# Altium schematic sheet Power.SchDoc
size A4
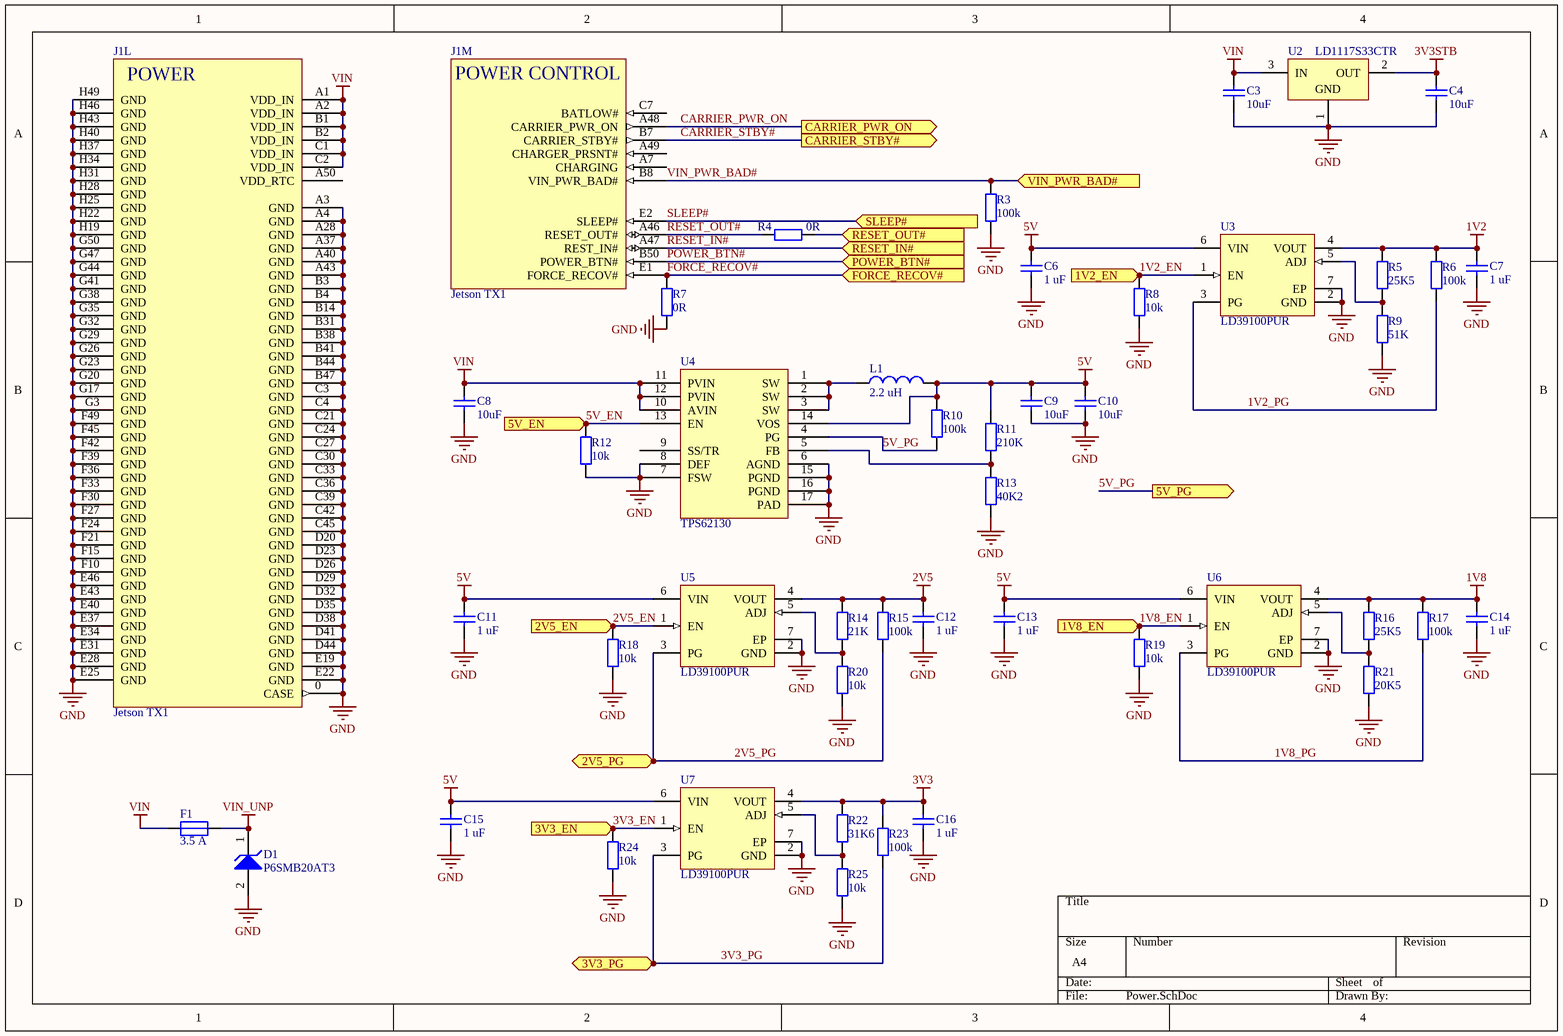
[diagram p0: Power.SchDoc]

## Parts
C3  value 10uF  [1206_1.6_M]  (hidden comment: TMK316B7106KL-TD)
C4  value 10uF  [0603C_M]  (hidden comment: GRM188R60J106ME47D)
C6  Capacitance: 1 uF  [0603C_M]  (hidden comment: GRM188R61A105KA61D)
C7  Capacitance: 1 uF  [0603C_M]  (hidden comment: GRM188R61A105KA61D)
C8  value 10uF  [1206_1.6_M]  (hidden comment: TMK316B7106KL-TD)
C9  value 10uF  [0603C_M]  (hidden comment: GRM188R60J106ME47D)
C10  value 10uF  [0603C_M]  (hidden comment: GRM188R60J106ME47D)
C11  Capacitance: 1 uF  [0603C_M]  (hidden comment: GRM188R61A105KA61D)
C12  Capacitance: 1 uF  [0603C_M]  (hidden comment: GRM188R61A105KA61D)
C13  Capacitance: 1 uF  [0603C_M]  (hidden comment: GRM188R61A105KA61D)
C14  Capacitance: 1 uF  [0603C_M]  (hidden comment: GRM188R61A105KA61D)
C15  Capacitance: 1 uF  [0603C_M]  (hidden comment: GRM188R61A105KA61D)
C16  Capacitance: 1 uF  [0603C_M]  (hidden comment: GRM188R61A105KA61D)
D1  P6SMB20AT3  [ONSC-SMB-2-403A-03_J_V]
F1  Current Rating: 3.5 A  [0603R_0.45_M]  (hidden comment: 0603SFV350F/32-2)
J1  Jetson TX1  [Nvidia Jetson TX1]  (parts L,M of 14)
L1  Inductance: 2.2 uH  [XFL4020_M]  (hidden comment: XFL4020-222MEC)
R3  Resistance: 100k  [0402R_M]  (hidden comment: CRCW0402100KJNED)
R4  value 0R  [0402R_M]  (hidden comment: Generic resitor)
R5  value 25K5  [0402R_M]  (hidden comment: CRCW040225K5FKED)
R6  Resistance: 100k  [0402R_M]  (hidden comment: CRCW0402100KJNED)
R7  value 0R  [0402R_M]  (hidden comment: Generic resitor)
R8  value 10k  [0402R_M]  (hidden comment: CRCW040210K0FKED)
R9  value 51K  [0402R_M]  (hidden comment: CRCW040251K0FKED)
R10  Resistance: 100k  [0402R_M]  (hidden comment: CRCW0402100KJNED)
R11  value 210K  [0402R_M]  (hidden comment: CRCW0402210KFKED)
R12  value 10k  [0402R_M]  (hidden comment: CRCW040210K0FKED)
R13  value 40K2  [0402R_M]  (hidden comment: CRCW040240K2FKED)
R14  value 21K  [0402R_M]  (hidden comment: CRCW040221K0FKED)
R15  Resistance: 100k  [0402R_M]  (hidden comment: CRCW0402100KJNED)
R16  value 25K5  [0402R_M]  (hidden comment: CRCW040225K5FKED)
R17  Resistance: 100k  [0402R_M]  (hidden comment: CRCW0402100KJNED)
R18  value 10k  [0402R_M]  (hidden comment: CRCW040210K0FKED)
R19  value 10k  [0402R_M]  (hidden comment: CRCW040210K0FKED)
R20  value 10k  [0402R_M]  (hidden comment: CRCW040210K0FKED)
R21  value 20K5  [0402R_M]  (hidden comment: CRCW040220K5FKED)
R22  value 31K6  [0402R_M]  (hidden comment: CRCW040231K6FKED)
R23  Resistance: 100k  [0402R_M]  (hidden comment: CRCW0402100KJNED)
R24  value 10k  [0402R_M]  (hidden comment: CRCW040210K0FKED)
R25  value 10k  [0402R_M]  (hidden comment: CRCW040210K0FKED)
U2  LD1117S33CTR  [SOT-223_L]
U3  LD39100PUR  [DFN6D_M]
U4  TPS62130  [VQFN1_16_L]
U5  LD39100PUR  [DFN6D_M]
U6  LD39100PUR  [DFN6D_M]
U7  LD39100PUR  [DFN6D_M]

## Ports
1V2_EN (in), 1V8_EN (in), 2V5_EN (in), 2V5_PG (out), 3V3_EN (in), 3V3_PG (out), 5V_EN (in), 5V_PG (out), CARRIER_PWR_ON (out), CARRIER_STBY# (out), FORCE_RECOV# (in), POWER_BTN# (in), RESET_IN# (in), RESET_OUT# (in), SLEEP# (in), VIN_PWR_BAD# (in)

## Nets
1V2: C7.2 R5.2 R6.2 U3.4(VOUT)
1V8: C14.2 R16.2 R17.2 U6.4(VOUT)
2V5: C12.2 R14.2 R15.2 U5.4(VOUT)
3V3: C16.2 R22.2 R23.2 U7.4(VOUT)
3V3STB: C4.2 U2.2(OUT)
5V: C6.2 C9.2 C10.2 C11.2 C13.2 C15.2 L1.2 R10.2 R11.2 U3.6(VIN) U4.14(VOS) U5.6(VIN) U6.6(VIN) U7.6(VIN)
GND: C3.1 C4.1 C6.1 C7.1 C8.1 C9.1 C10.1 C11.1 C12.1 C13.1 C14.1 C15.1 C16.1 D1.2(A) J1.0(CASE) J1.A3(GND) J1.A4(GND) J1.A28(GND) J1.A37(GND) J1.A40(GND) J1.A43(GND) J1.B3(GND) J1.B4(GND) J1.B14(GND) J1.B31(GND) J1.B38(GND) J1.B41(GND) J1.B44(GND) J1.B47(GND) J1.C3(GND) J1.C4(GND) J1.C21(GND) J1.C24(GND) J1.C27(GND) J1.C30(GND) J1.C33(GND) J1.C36(GND) J1.C39(GND) J1.C42(GND) J1.C45(GND) J1.D20(GND) J1.D23(GND) J1.D26(GND) J1.D29(GND) J1.D32(GND) J1.D35(GND) J1.D38(GND) J1.D41(GND) J1.D44(GND) J1.E19(GND) J1.E22(GND) J1.E25(GND) J1.E28(GND) J1.E31(GND) J1.E34(GND) J1.E37(GND) J1.E40(GND) J1.E43(GND) J1.E46(GND) J1.F10(GND) J1.F15(GND) J1.F21(GND) J1.F24(GND) J1.F27(GND) J1.F30(GND) J1.F33(GND) J1.F36(GND) J1.F39(GND) J1.F42(GND) J1.F45(GND) J1.F49(GND) J1.G3(GND) J1.G17(GND) J1.G20(GND) J1.G23(GND) J1.G26(GND) J1.G29(GND) J1.G32(GND) J1.G35(GND) J1.G38(GND) J1.G41(GND) J1.G44(GND) J1.G47(GND) J1.G50(GND) J1.H19(GND) J1.H22(GND) J1.H25(GND) J1.H28(GND) J1.H31(GND) J1.H34(GND) J1.H37(GND) J1.H40(GND) J1.H43(GND) J1.H46(GND) J1.H49(GND) R3.1 R7.1 R8.1 R9.1 R12.1 R13.1 R18.1 R19.1 R20.1 R21.1 R24.1 R25.1 U2.1(GND) U3.2(GND) U3.7(EP) U4.6(AGND) U4.7(FSW) U4.8(DEF) U4.15(PGND) U4.16(PGND) U4.17(PAD) U5.2(GND) U5.7(EP) U6.2(GND) U6.7(EP) U7.2(GND) U7.7(EP)
VIN: C3.2 C8.2 F1.1 J1.A1(VDD_IN) J1.A2(VDD_IN) J1.B1(VDD_IN) J1.B2(VDD_IN) J1.C1(VDD_IN) J1.C2(VDD_IN) U2.3(IN) U4.10(AVIN) U4.11(PVIN) U4.12(PVIN)
VIN_UNP: D1.1(K) F1.2
1V2_EN: R8.2 U3.1(EN) ; port 1V2_EN
1V2_PG: R6.1 U3.3(PG)
1V8_EN: R19.2 U6.1(EN) ; port 1V8_EN
1V8_PG: R17.1 U6.3(PG)
2V5_EN: R18.2 U5.1(EN) ; port 2V5_EN
2V5_PG: R15.1 U5.3(PG) ; port 2V5_PG
3V3_EN: R24.2 U7.1(EN) ; port 3V3_EN
3V3_PG: R23.1 U7.3(PG) ; port 3V3_PG
5V_EN: R12.2 U4.13(EN) ; port 5V_EN
5V_PG: R10.1 U4.4(PG) ; port 5V_PG
CARRIER_PWR_ON: J1.A48(CARRIER_PWR_ON) ; port CARRIER_PWR_ON
CARRIER_STBY#: J1.B7(CARRIER_STBY#) ; port CARRIER_STBY#
FORCE_RECOV#: J1.E1(FORCE_RECOV#) R7.2 ; port FORCE_RECOV#
POWER_BTN#: J1.B50(POWER_BTN#) ; port POWER_BTN#
RESET_IN#: J1.A47(REST_IN#) ; port RESET_IN#
RESET_OUT#: J1.A46(RESET_OUT#) R4.1
RESET_OUT#: R4.2 ; port RESET_OUT#  [a separate net that carries the same name]
SLEEP#: J1.E2(SLEEP#) ; port SLEEP#
VIN_PWR_BAD#: J1.B8(VIN_PWR_BAD#) R3.2 ; port VIN_PWR_BAD#
NetL1_1: L1.1 U4.1(SW) U4.2(SW) U4.3(SW)
NetR5_1: R5.1 R9.2 U3.5(ADJ)
NetR11_1: R11.1 R13.2 U4.5(FB)
NetR14_1: R14.1 R20.2 U5.5(ADJ)
NetR16_1: R16.1 R21.2 U6.5(ADJ)
NetR22_1: R22.1 R25.2 U7.5(ADJ)

Not connected (* = marked no-connect by the designer): J1 A7(CHARGING) A49(CHARGER_PRSNT#) A50(VDD_RTC) C7(BATLOW#); U4 9(SS/TR)

## Notes on the sheet
- (in symbol NVIDIA_Jetson_TX1, part L) POWER
- (in symbol NVIDIA_Jetson_TX1, part M) POWER CONTROL

## Library data of the parts
C3 C8 = TMK316B7106KL-TD: CAP CER 1206 10uF 25V X7R 10%; Manufacturer: Taiyo Yuden; Type: Multilayer Ceramic Capacitor; Voltage Rating DC: 25 VDC; Qualification: AEC-Q200; Manufacturer Part Number: TMK316B7106KL-TD; RoHS: RoHS Compliant; Category: Multilayer Ceramic Capacitors MLCC - SMD/SMT; Capacitance: 10 uF; Height: 1.6 mm; Length: 3.2 mm; Package/Case: 1206 (3216 metric); Packaging: Reel; Product: General Type MLCCs; Series: M; Termination Style: SMD/SMT; Tolerance: 10 %; Width: 1.6 mm; Brand: Taiyo Yuden; Case Code - in: 1206; Case Code - mm: 3216; Dielectric: X7R; Maximum Operating Temperature: + 125 C; Minimum Operating Temperature: - 55 C; Standard Pack Qty: 2000; RoHS - Mouser: Y; Minimum Order Quantity: 1; Reeling: True; ComponentLink1URL: http://www.mouser.com/ds/2/396/mlcc_all_e-541559.pdf; ComponentLink1Description: http://www.mouser.com/ds/2/396/mlcc_all_e-541559.pdf
C4 C9 C10 = GRM188R60J106ME47D: CAP CER 10UF 6.3V X5R 0603; Manufacturer: Murata Electronics North America; Tolerance: ±20%; Supplier 1: Digi-Key; Manufacturer Part Number: GRM188R60J106ME47D; RoHS: RoHS Compliant; Category: Capacitors; Stock 1: 13697850; Pricing 1: 1=0.17, 10=0.123, 100=0.0578, 500=0.04052, 1000=0.03355 (USD); Packaging: Cut Tape (CT); Part Status: Active; Voltage - Rated: 6.3V; Temperature Coefficient: X5R; Operating Temperature: -55°C ~ 85°C; Features: -; Ratings: -; Applications: General Purpose; Mounting Type: Surface Mount, MLCC; Package / Case: 0603 (1608 Metric); Size / Dimension: 0.063" L x 0.031" W (1.60mm x 0.80mm); Height - Seated (Max): -; Thickness (Max): 0.035" (0.90mm); Lead Spacing: -; Lead Style: -; ComponentLink1URL: http://www.murata.com/~/media/webrenewal/support/library/catalog/products/capacitor/mlcc/c02e.pdf; ComponentLink1Description: http://www.murata.com/~/media/webrenewal/support/library/catalog/products/capacitor/mlcc/c02e.pdf; Supplier Part Number 1: 490-3896-1-ND
C6 C7 C11-C16 = GRM188R61A105KA61D: CAP CER 1UF 10V X5R 0603; Manufacturer: Murata; Capacitance - nF: 1000 nF; Brand: Murata Electronics; Tolerance: 10 %; Case Height: 0.8 mm; Case Length: 1.6 mm; Temperature Coefficient / Code: +/- 15 %; Type: General Purpose MLCC; Supplier 1: Digi-Key; Manufacturer Part Number: GRM188R61A105KA61D; Stock 1: 2238936; Pricing 1: 1=0.1, 10=0.04, 100=0.0178, 500=0.0127, 1000=0.01 (USD); Dimensions: 0.8 mm W x 1.6 mm L x 0.8 mm H; Product Category: Multilayer Ceramic Capacitors MLCC - SMD/SMT; RoHS: Details; Voltage Rating DC: 10 V; Dielectric: X5R; Case Code - in: 0603; Case Code - mm: 1608; Minimum Operating Temperature: - 55 C; Maximum Operating Temperature: + 85 C; Product: General Type MLCCs; Case Width: 0.8 mm; Operating Temperature Range: - 55 C to + 85 C; Package / Case: 0603 (1608 metric); Packaging: Reel; Series: GRM; Factory Pack Quantity: 4000; Termination Style: SMD/SMT; ComponentLink1URL: https://datasheet.ciiva.com/18102/getdatasheetpartid-85467-18102910.pdf; ComponentLink1Description: https://datasheet.ciiva.com/18102/getdatasheetpartid-85467-18102910.pdf; ComponentLink2URL: https://datasheet.ciiva.com/19476/1857381-19476568.pdf; ComponentLink2Description: https://datasheet.ciiva.com/19476/1857381-19476568.pdf; ComponentLink3URL: https://datasheet.ciiva.com/131/partnumbering-e-01-131743.pdf; ComponentLink3Description: https://datasheet.ciiva.com/131/partnumbering-e-01-131743.pdf; ComponentLink4URL: https://datasheet.ciiva.com/22706/608985-22706782.pdf; ComponentLink4Description: https://datasheet.ciiva.com/22706/608985-22706782.pdf; ComponentLink5URL: https://datasheet.ciiva.com/131/partnumbering-e-01-131742.pdf; ComponentLink5Description: https://datasheet.ciiva.com/131/partnumbering-e-01-131742.pdf; ComponentLink6URL: https://datasheet.ciiva.com/7719/608985-7719036.pdf; ComponentLink6Description: https://datasheet.ciiva.com/7719/608985-7719036.pdf; ComponentLink7URL: https://datasheet.ciiva.com/16199/product-16199724.pdf; ComponentLink7Description: https://datasheet.ciiva.com/16199/product-16199724.pdf; ComponentLink8URL: https://datasheet.ciiva.com/131/partnumbering-e-01-131741.pdf; ComponentLink8Description: https://datasheet.ciiva.com/131/partnumbering-e-01-131741.pdf; Supplier Part Number 1: 490-1543-1-ND; Voltage Rating: 10 V
D1 = CMP-1061-00394-1: 600 W Peak Power Zener Transient Voltage Suppressor, Unidirectional, 2-Pin SMB, Tape and Reel; Manufacturer: On Semiconductor; PPK Max (W): 600; IR Max (uA): 5; V(BR) Typ (V): 20; PartNumber: P6SMB20AT3; Direction: Unidirectional; ComponentLink2URL: http://www.onsemi.com/pub_link/Collateral/P6SMB6.8AT3-D.PDF; PackageVersion: Rev. J, 07/2012; ComponentLink1URL: http://www.onsemi.com/; PackageReference: SMB-2-403A-03_J; Mounting Technology: Surface Mount; DatasheetVersion: Rev. J; ComponentLink2Description: Datasheet; Packing: Tape and Reel; ComponentLink1Description: Manufacturer URL; ComponentLink3Description: Package Specification; ComponentLink3URL: http://www.onsemi.com/pub_link/Collateral/P6SMB6.8AT3-D.PDF; PackageDescription: 2-Pin Small Molded Package, J-Bend Lead, Body 4.33 x 3.625 mm
F1 = 0603SFV350F/32-2: FUSE 0603 3.5A FAST; Manufacturer: TE Connectivity / Raychem; Voltage Rating DC: 32 VDC; Fuse Size / Group: 0603 (1608 metric); Fuse Type: Fast Blow; Interrupt Rating: 35 Amps; Supplier 1: Mouser; Manufacturer Part Number: 0603SFV350F/32-2; RoHS: RoHS Compliant; Category: Surface Mount Fuses; Stock 1: 16912; Pricing 1: 1=0.824, 10=0.621, 100=0.518, 250=0.505, 500=0.427, 1000=0.376, 2500=0.349, 6000=0.337, 12000=0.332 (EUR); Height: 0.51 mm; Length: 1.75 mm; Operating Temperature Range: - 55 C to + 125 C; Packaging: Reel; Product: Surface Mount Fuse; Series: SFV; Width: 0.48 mm; Brand: TE Connectivity / Raychem; Standard Pack Qty: 6000; RoHS - Mouser: Y; Minimum Order Quantity: 1; Reeling: True; ComponentLink1URL: http://www.mouser.com/ds/2/418/NG_CS_CLP00009_A_CLP00009-735180.pdf; ComponentLink1Description: http://www.mouser.com/ds/2/418/NG_CS_CLP00009_A_CLP00009-735180.pdf; Supplier Part Number 1: 650-0603SFV350F/32-2
J1 = NVIDIA_Jetson_TX1: Nvidia computing module
L1 = XFL4020-222MEC: Fixed Inductors Power Inductor 2.2 uH 20 % 8 A / Learn More; Manufacturer: Coilcraft; Part # Aliases: XFL4020-222MEB; Case Height: 2.1 mm; Case Length: 4.3 mm; Core Material: Composite; Maximum DC Current: 8 A; Maximum DC Resistance: 23.5 mOhms; Tolerance: 20 %; Self Resonant Frequency: 38 MHz; Shielding: Shielded; Test Frequency: 100 kHz; Supplier 1: Farnell; Manufacturer Part Number: XFL4020-222MEC; Stock 1: 19632; Pricing 1: 1=2.09, 50=1.81, 100=1.52, 250=1.18 (EUR); Dimensions: 4.3 mm W x 4.3 mm L x 2.1 mm H; Case Width: 4.3 mm; RoHS: Details; Operating Temperature Range: - 40 C to + 125 C; Packaging: Reel; Product: Power Inductors; Termination Style: SMD/SMT; Series: XFL4020; ComponentLink1URL: https://datasheet.ciiva.com/22679/1682010-22679278.pdf; ComponentLink1Description: https://datasheet.ciiva.com/22679/1682010-22679278.pdf; ComponentLink2URL: https://datasheet.ciiva.com/22679/1682010-22679277.pdf; ComponentLink2Description: https://datasheet.ciiva.com/22679/1682010-22679277.pdf; Supplier Part Number 1: 2289216
R3 R6 R10 R15 R17 R23 = CRCW0402100KJNED: RES SMD 100K OHM 5% 1/16W 0402; Manufacturer: Vishay; Brand: Vishay / Dale; Power Rating: 63 mW; Temperature Coefficient: 200 PPM / K; Voltage Rating: 50 V; Unit Weight: 0.000023 oz; Supplier 1: Digi-Key; Manufacturer Part Number: CRCW0402100KJNED; Stock 1: 174; Pricing 1: 1=0.1, 10=0.025, 100=0.01, 1000=0.0045, 2500=0.0039, 5000=0.0032 (USD); Product Category: Thick Film Resistors - SMD; RoHS: Details; Tolerance: 5 %; Case Code - in: 0402; Case Code - mm: 1005; Operating Temperature Range: - 55 C to + 155 C; Series: CRCW; Height: 0.35 mm; Length: 1 mm; Package / Case: 0402 (1005 metric); Packaging: Reel; Product: Thick Film Resistors SMD; Factory Pack Quantity: 10000; Termination Style: SMD/SMT; Width: 0.5 mm; ComponentLink1URL: https://datasheet.ciiva.com/3255/dcrcwe3-3255949.pdf; ComponentLink1Description: https://datasheet.ciiva.com/3255/dcrcwe3-3255949.pdf; ComponentLink2URL: https://datasheet.ciiva.com/28420/dcrcwe3-28420124.pdf; ComponentLink2Description: https://datasheet.ciiva.com/28420/dcrcwe3-28420124.pdf; ComponentLink3URL: https://datasheet.ciiva.com/3255/dcrcwe3-3255950.pdf; ComponentLink3Description: https://datasheet.ciiva.com/3255/dcrcwe3-3255950.pdf; ComponentLink4URL: https://datasheet.ciiva.com/28621/1847332-28621326.pdf; ComponentLink4Description: https://datasheet.ciiva.com/28621/1847332-28621326.pdf; ComponentLink5URL: https://datasheet.ciiva.com/16763/70201119-16763038.pdf; ComponentLink5Description: https://datasheet.ciiva.com/16763/70201119-16763038.pdf; ComponentLink6URL: https://datasheet.ciiva.com/2461/dcrcwe3-2461990.pdf; ComponentLink6Description: https://datasheet.ciiva.com/2461/dcrcwe3-2461990.pdf; ComponentLink7URL: https://datasheet.ciiva.com/2461/dcrcwe3-2461989.pdf; ComponentLink7Description: https://datasheet.ciiva.com/2461/dcrcwe3-2461989.pdf; ComponentLink8URL: https://datasheet.ciiva.com/2461/dcrcwe3-2461991.pdf; ComponentLink8Description: https://datasheet.ciiva.com/2461/dcrcwe3-2461991.pdf; ComponentLink9URL: https://datasheet.ciiva.com/7777/1533075-7777191.pdf; ComponentLink9Description: https://datasheet.ciiva.com/7777/1533075-7777191.pdf; ComponentLink10URL: https://datasheet.ciiva.com/5552/dcrcwe3-109170-5552439.pdf; ComponentLink10Description: https://datasheet.ciiva.com/5552/dcrcwe3-109170-5552439.pdf; Supplier Part Number 1: 541-100KJDKR-ND
R4 R7 = Resistor
R5 R16 = CRCW040225K5FKED: RES SMD 25.5K OHM 1% 1/16W 0402; Manufacturer: Vishay Dale; Power (Watts): 0.063W, 1/16W; Temperature Coefficient: ±100ppm/°C; Supplier 1: Digi-Key; Manufacturer Part Number: CRCW040225K5FKED; RoHS: RoHS Compliant; Category: Resistors; Stock 1: 51405; Pricing 1: 1=0.1, 10=0.037, 100=0.0149, 1000=0.0067, 2500=0.00582, 5000=0.00481 (USD); Packaging: Cut Tape (CT); Part Status: Active; Tolerance: ±1%; Composition: Thick Film; Features: Automotive AEC-Q200; Operating Temperature: -55°C ~ 155°C; Package / Case: 0402 (1005 Metric); Supplier Device Package: 0402; Size / Dimension: 0.039" L x 0.020" W (1.00mm x 0.50mm); Height - Seated (Max): 0.016" (0.40mm); Failure Rate: -; ComponentLink1URL: http://www.vishay.com/docs/20035/dcrcwe3.pdf; ComponentLink1Description: http://www.vishay.com/docs/20035/dcrcwe3.pdf; Supplier Part Number 1: 541-25.5KLCT-ND
R8 R12 R18-R20 R24 R25 = CRCW040210K0FKED: RES SMD 10K OHM 1% 1/16W 0402; Manufacturer: Vishay Dale; Power (Watts): 0.063W, 1/16W; Temperature Coefficient: ±100ppm/°C; Supplier 1: Digi-Key; Manufacturer Part Number: CRCW040210K0FKED; RoHS: RoHS Compliant; Category: Resistors; Stock 1: 0; Pricing 1: 1=0.1, 10=0.037, 100=0.0149, 1000=0.0067, 2500=0.00582, 5000=0.00481 (USD); Packaging: Cut Tape (CT); Part Status: Active; Tolerance: ±1%; Composition: Thick Film; Features: Automotive AEC-Q200; Operating Temperature: -55°C ~ 155°C; Package / Case: 0402 (1005 Metric); Supplier Device Package: 0402; Size / Dimension: 0.039" L x 0.020" W (1.00mm x 0.50mm); Height - Seated (Max): 0.016" (0.40mm); Failure Rate: -; ComponentLink1URL: http://www.vishay.com/docs/20035/dcrcwe3.pdf; ComponentLink1Description: http://www.vishay.com/docs/20035/dcrcwe3.pdf; Supplier Part Number 1: 541-10.0KLCT-ND
R9 = CRCW040251K0FKED: RES SMD 51K OHM 1% 1/16W 0402; Manufacturer: Vishay Dale; Power (Watts): 0.063W, 1/16W; Temperature Coefficient: ±100ppm/°C; Supplier 1: Digi-Key; Manufacturer Part Number: CRCW040251K0FKED; RoHS: RoHS Compliant; Category: Resistors; Stock 1: 5300; Pricing 1: 1=0.1, 10=0.037, 100=0.0149, 1000=0.0067, 2500=0.00582, 5000=0.00481 (USD); Packaging: Cut Tape (CT); Part Status: Active; Tolerance: ±1%; Composition: Thick Film; Features: Automotive AEC-Q200; Operating Temperature: -55°C ~ 155°C; Package / Case: 0402 (1005 Metric); Supplier Device Package: 0402; Size / Dimension: 0.039" L x 0.020" W (1.00mm x 0.50mm); Height - Seated (Max): 0.016" (0.40mm); Failure Rate: -; ComponentLink1URL: http://www.vishay.com/docs/20035/dcrcwe3.pdf; ComponentLink1Description: http://www.vishay.com/docs/20035/dcrcwe3.pdf; Supplier Part Number 1: 541-51.0KLCT-ND
R11 = CRCW0402210KFKED: RES SMD 210K OHM 1% 1/16W 0402; Manufacturer: Vishay Dale; Power (Watts): 0.063W, 1/16W; Temperature Coefficient: ±100ppm/°C; Supplier 1: Digi-Key; Manufacturer Part Number: CRCW0402210KFKED; RoHS: RoHS Compliant; Category: Resistors; Stock 1: 30018; Pricing 1: 1=0.1, 10=0.037, 100=0.0149, 1000=0.0067, 2500=0.00582, 5000=0.00481 (USD); Packaging: Cut Tape (CT); Part Status: Active; Tolerance: ±1%; Composition: Thick Film; Features: Automotive AEC-Q200; Operating Temperature: -55°C ~ 155°C; Package / Case: 0402 (1005 Metric); Supplier Device Package: 0402; Size / Dimension: 0.039" L x 0.020" W (1.00mm x 0.50mm); Height - Seated (Max): 0.016" (0.40mm); Failure Rate: -; ComponentLink1URL: http://www.vishay.com/docs/20035/dcrcwe3.pdf; ComponentLink1Description: http://www.vishay.com/docs/20035/dcrcwe3.pdf; Supplier Part Number 1: 541-210KLCT-ND
R13 = CRCW040240K2FKED: RES SMD 40.2K OHM 1% 1/16W 0402; Manufacturer: Vishay Dale; Power (Watts): 0.063W, 1/16W; Temperature Coefficient: ±100ppm/°C; Supplier 1: Digi-Key; Manufacturer Part Number: CRCW040240K2FKED; RoHS: RoHS Compliant; Category: Resistors; Stock 1: 27736; Pricing 1: 1=0.1, 10=0.037, 100=0.0149, 1000=0.0067, 2500=0.00582, 5000=0.00481 (USD); Packaging: Cut Tape (CT); Part Status: Active; Tolerance: ±1%; Composition: Thick Film; Features: Automotive AEC-Q200; Operating Temperature: -55°C ~ 155°C; Package / Case: 0402 (1005 Metric); Supplier Device Package: 0402; Size / Dimension: 0.039" L x 0.020" W (1.00mm x 0.50mm); Height - Seated (Max): 0.016" (0.40mm); Failure Rate: -; ComponentLink1URL: http://www.vishay.com/docs/20035/dcrcwe3.pdf; ComponentLink1Description: http://www.vishay.com/docs/20035/dcrcwe3.pdf; Supplier Part Number 1: 541-40.2KLCT-ND
R14 = CRCW040221K0FKED: RES SMD 21K OHM 1% 1/16W 0402; Manufacturer: Vishay Dale; Power (Watts): 0.063W, 1/16W; Temperature Coefficient: ±100ppm/°C; Supplier 1: Digi-Key; Manufacturer Part Number: CRCW040221K0FKED; RoHS: RoHS Compliant; Category: Resistors; Stock 1: 0; Pricing 1: 1=0.1, 10=0.037, 100=0.0149, 1000=0.0067, 2500=0.00582, 5000=0.00481 (USD); Packaging: Cut Tape (CT); Part Status: Active; Tolerance: ±1%; Composition: Thick Film; Features: Automotive AEC-Q200; Operating Temperature: -55°C ~ 155°C; Package / Case: 0402 (1005 Metric); Supplier Device Package: 0402; Size / Dimension: 0.039" L x 0.020" W (1.00mm x 0.50mm); Height - Seated (Max): 0.016" (0.40mm); Failure Rate: -; ComponentLink1URL: http://www.vishay.com/docs/20035/dcrcwe3.pdf; ComponentLink1Description: http://www.vishay.com/docs/20035/dcrcwe3.pdf; Supplier Part Number 1: 541-21.0KLCT-ND
R21 = CRCW040220K5FKED: RES SMD 20.5K OHM 1% 1/16W 0402; Manufacturer: Vishay Dale; Power (Watts): 0.063W, 1/16W; Temperature Coefficient: ±100ppm/°C; Supplier 1: Digi-Key; Manufacturer Part Number: CRCW040220K5FKED; RoHS: RoHS Compliant; Category: Resistors; Stock 1: 0; Pricing 1: 1=0.1, 10=0.037, 100=0.0149, 1000=0.0067, 2500=0.00582, 5000=0.00481 (USD); Packaging: Cut Tape (CT); Part Status: Active; Tolerance: ±1%; Composition: Thick Film; Features: Automotive AEC-Q200; Operating Temperature: -55°C ~ 155°C; Package / Case: 0402 (1005 Metric); Supplier Device Package: 0402; Size / Dimension: 0.039" L x 0.020" W (1.00mm x 0.50mm); Height - Seated (Max): 0.016" (0.40mm); Failure Rate: -; ComponentLink1URL: http://www.vishay.com/docs/20035/dcrcwe3.pdf; ComponentLink1Description: http://www.vishay.com/docs/20035/dcrcwe3.pdf; Supplier Part Number 1: 541-20.5KLCT-ND
R22 = CRCW040231K6FKED: RES SMD 31.6K OHM 1% 1/16W 0402; Manufacturer: Vishay Dale; Power (Watts): 0.063W, 1/16W; Temperature Coefficient: ±100ppm/°C; Supplier 1: Digi-Key; Manufacturer Part Number: CRCW040231K6FKED; RoHS: RoHS Compliant; Category: Resistors; Stock 1: 0; Pricing 1: 1=0.1, 10=0.037, 100=0.0149, 1000=0.0067, 2500=0.00582, 5000=0.00481 (USD); Packaging: Cut Tape (CT); Part Status: Active; Tolerance: ±1%; Composition: Thick Film; Features: Automotive AEC-Q200; Operating Temperature: -55°C ~ 155°C; Package / Case: 0402 (1005 Metric); Supplier Device Package: 0402; Size / Dimension: 0.039" L x 0.020" W (1.00mm x 0.50mm); Height - Seated (Max): 0.016" (0.40mm); Failure Rate: -; ComponentLink1URL: http://www.vishay.com/docs/20035/dcrcwe3.pdf; ComponentLink1Description: http://www.vishay.com/docs/20035/dcrcwe3.pdf; Supplier Part Number 1: 541-31.6KLCT-ND
U2 = LD1117S33CTR: IC REG LDO 3.3V 0.8A SOT223; Manufacturer: STMicroelectronics; Regulator Topology: Positive Fixed; Current - Output: 800mA; Voltage - Dropout (Typical): 1.1V @ 800mA; Voltage - Input: Up to 15V; Supplier 1: Digi-Key; Manufacturer Part Number: LD1117S33CTR; RoHS: RoHS Compliant; Category: Integrated Circuits (ICs); Stock 1: 22602; Pricing 1: 1=0.46, 10=0.373, 100=0.2538, 500=0.19034, 1000=0.14276 (USD); Packaging: Cut Tape (CT); Part Status: Active; Voltage - Output: 3.3V; Current - Limit (Min): -; Operating Temperature: -40°C ~ 125°C; Mounting Type: Surface Mount; Package / Case: TO-261-4, TO-261AA; Supplier Device Package: SOT-223; ComponentLink1URL: http://www.st.com/content/ccc/resource/technical/document/datasheet/99/3b/7d/91/91/51/4b/be/CD00000544.pdf/files/CD00000544.pdf/jcr:content/translations/en.CD00000544.pdf; ComponentLink1Description: http://www.st.com/content/ccc/resource/technical/document/datasheet/99/3b/7d/91/91/51/4b/be/CD00000544.pdf/files/CD00000544.pdf/jcr:content/translations/en.CD00000544.pdf; Supplier Part Number 1: 497-1241-1-ND
U3 U5-U7 = CMP-0244-00287-1: 1 A Low Quiescent Current Low Noise Voltage Regulator, Adjustable from 0.8V, 6-Pin VFDFPN, Tape and Reel; ComponentLink1URL: http://www.st.com; ComponentLink1Description: Manufacturer URL; ComponentLink2Description: Datasheet; DatasheetVersion: 1/10/2011; PackageDescription: 6-Pin Plastic, Dual LLP, 3 x 3 mm Body, 0.95 mm Pitch, Exposed Pad; PackageReference: DFN6D; ComponentLink2URL: http://www.st.com/internet/com/TECHNICAL_RESOURCES/TECHNICAL_LITERATURE/DATASHEET/CD00233788.pdf; PackageVersion: 2008
U4 = TPS62130RGTT: IC REG BUCK ADJ 3A SYNC 16QFN; Manufacturer: Texas Instruments; Function: Step-Down; Output Configuration: Positive; Output Type: Adjustable; Number of Outputs: 1; Voltage - Input (Min): 3V; Voltage - Input (Max): 17V; Voltage - Output (Min/Fixed): 0.9V; Voltage - Output (Max): 6V; Frequency - Switching: 2.5MHz; Synchronous Rectifier: Yes; Supplier 1: Digi-Key; Manufacturer Part Number: TPS62130RGTT; RoHS: RoHS Compliant; Category: Integrated Circuits (ICs); Stock 1: 6750; Pricing 1: 250=1.98, 1250=1.13875 (USD); Packaging: Tape & Reel (TR); Part Status: Active; Topology: Buck; Current - Output: 3A; Operating Temperature: -40°C ~ 85°C (TA); Mounting Type: Surface Mount; Package / Case: 16-VFQFN Exposed Pad; Supplier Device Package: 16-QFN (3x3); ComponentLink1URL: http://www.ti.com/lit/ds/symlink/tps62130.pdf; ComponentLink1Description: http://www.ti.com/lit/ds/symlink/tps62130.pdf; Supplier Part Number 1: 296-29934-2-ND